# EAGLE design ledpar56 (EAGLE 6.4)
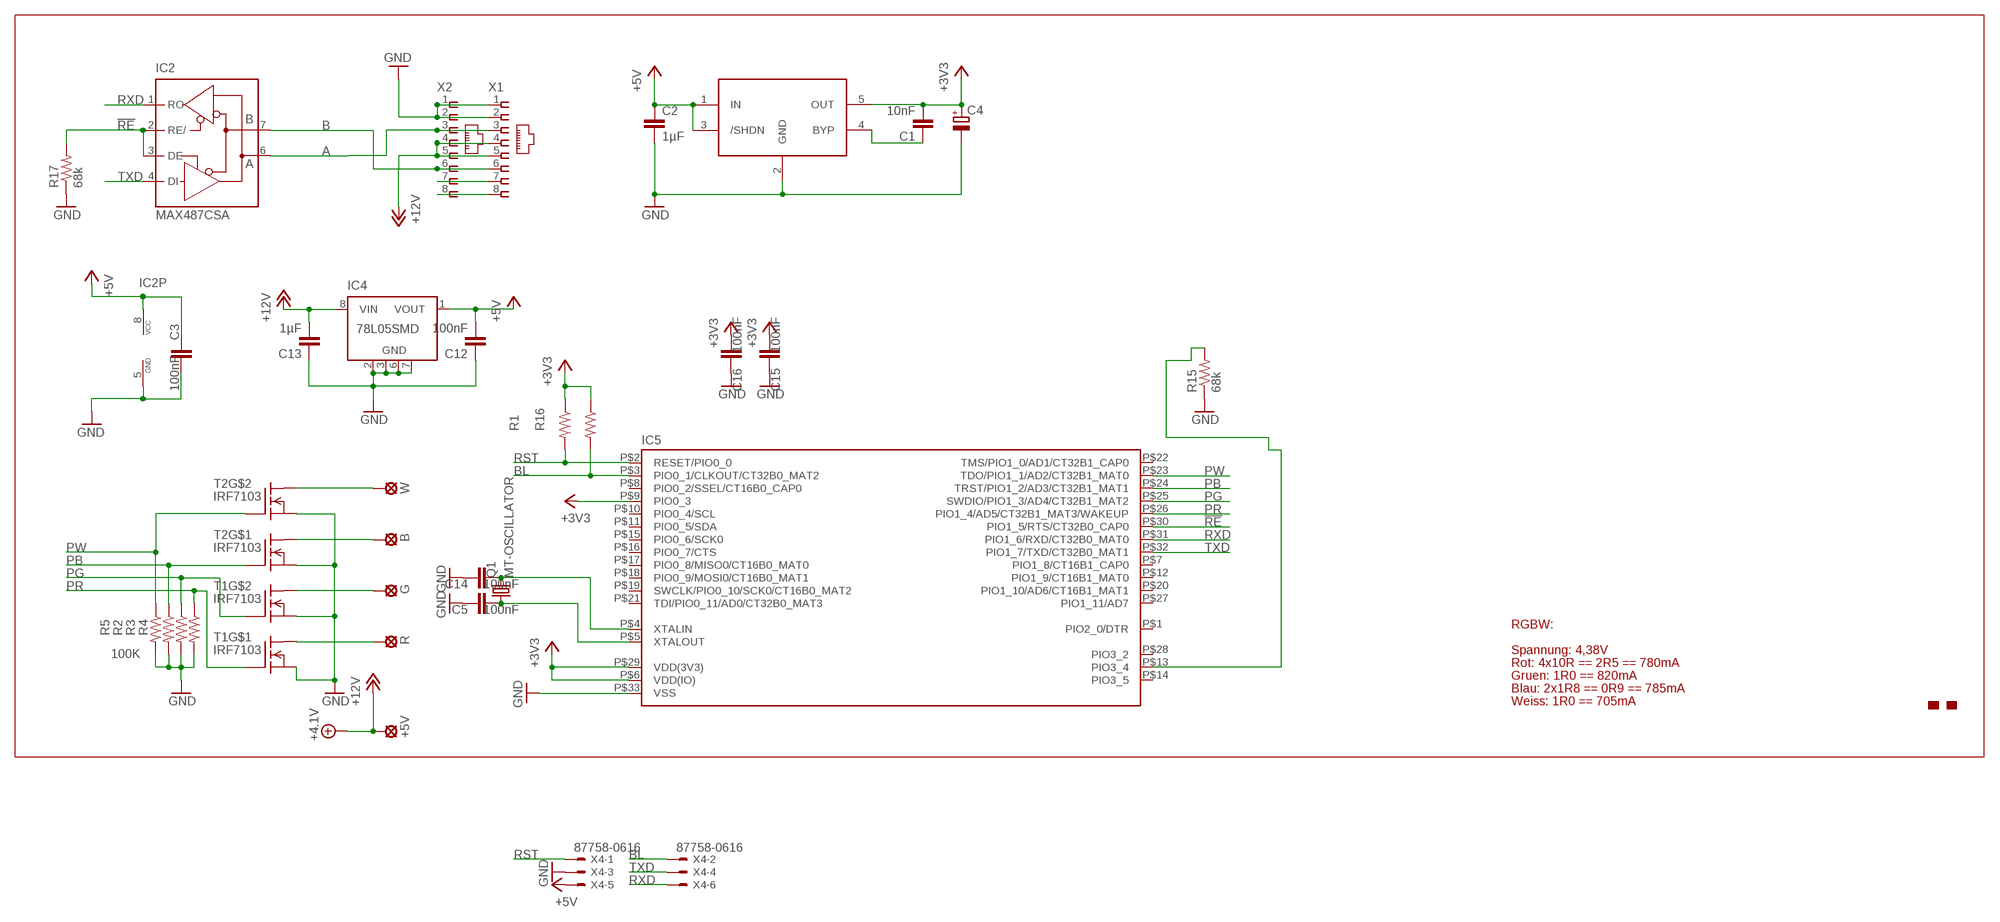
[diagram p0: schematic, sheet 1]

## Parts
+5V  SE14  [SE14]
B  SE14  [SE14]
C1  10nF  C-EUC0402  [C0402]
C2  1µF  CAP0805  [0805]
C3  100nF  CAP0402-CAP  [0402-CAP]
C4  CPOL-EUSMCA  [SMC_A]
C5  100nF  CAP0402-CAP  [0402-CAP]
C12  100nF  CAP0402-CAP  [0402-CAP]
C13  1µF  CAP0805  [0805]
C14  100nF  CAP0402-CAP  [0402-CAP]
C15  100nF  CAP0402-CAP  [0402-CAP]
C16  100nF  CAP0402-CAP  [0402-CAP]
G  SE14  [SE14]
IC1  LT1761  [SOT23-5L]
IC2  MAX487CSA  MAX481CSA  [SO08]
IC4  78L05SMD  [SO08]
IC5  LPC1113/4_QFN  [HVQFN33-7X7]
Q1  MT-OSCILLATOR  [MT]
R  SE14  [SE14]
R1  100K  RESISTOR0402-RES  [0402-RES]
R2  100K  RESISTOR0402-RES  [0402-RES]
R3  100K  RESISTOR0402-RES  [0402-RES]
R4  100K  RESISTOR0402-RES  [0402-RES]
R5  100K  RESISTOR0402-RES  [0402-RES]
R15  68k  RESISTOR0402-RES  [0402-RES]
R16  100K  RESISTOR0402-RES  [0402-RES]
R17  68k  RESISTOR0402-RES  [0402-RES]
T1  IRF7103  [SO-8]
T2  IRF7103  [SO-8]
U$1  MAKE-DD_LOGO'PROMPT'  [MAKE-DD_LOGO_PROMPT]
W  SE14  [SE14]
X1  RJ45-8L-B  [RJ45-NO-SHIELD]
X2  RJ45-8L-B  [RJ45-NO-SHIELD]
X4  87758-0616  [87758-0616]

## Nets
!RE: IC2.2(RE/) IC2.3(DE) IC5.P$30(PIO1_5/RTS/CT32B0_CAP0) R17.2
+3V3: C1.2 C4.+ C15.2 C16.2 IC1.5(OUT) IC5.P$6(VDD(IO)) IC5.P$9(PIO0_3) IC5.P$29(VDD(3V3)) R1.1 R16.1
+5V: C2.1 C3.1 C12.2 IC1.1(IN) IC1.3(/SHDN) IC2.8(VCC) IC4.1(VOUT) X4.5
+12V: +5V.MP C13.2 IC4.8(VIN) X1.4 X1.5 X2.4 X2.5 ; supply symbol labelled +4.1V
A: IC2.6(A) X1.3 X2.3
B: IC2.7(B) X1.6 X2.6
BL: IC5.P$3(PIO0_1/CLKOUT/CT32B0_MAT2) R16.2 X4.2
GND: C2.2 C3.2 C4.- C5.1 C12.1 C13.1 C14.1 C15.1 C16.1 IC1.2(GND) IC2.5(GND) IC4.2(GND) IC4.3(GND) IC4.6(GND) IC4.7(GND) IC5.P$33(VSS) R2.2 R3.2 R4.2 R5.2 R15.1 R17.1 T1.1(S) T1.3(S) T2.1(S) T2.3(S) X1.1 X1.2 X2.1 X2.2 X4.3
N$1: R.MP T1.8(D1)
N$2: T2.5(D1) W.MP
N$7: C1.1 IC1.4(BYP)
N$8: G.MP T1.5(D1)
N$9: B.MP T2.8(D1)
N$12: IC5.P$13(PIO3_4) R15.2
N$18: X1.7 X2.7
N$19: X1.8 X2.8
N$20: C5.2 IC5.P$5(XTALOUT) Q1.1
N$21: C14.2 IC5.P$4(XTALIN) Q1.3
PB: IC5.P$24(TRST/PIO1_2/AD3/CT32B1_MAT1) R2.1 T2.2(G)
PG: IC5.P$25(SWDIO/PIO1_3/AD4/CT32B1_MAT2) R3.1 T1.4(G)
PR: IC5.P$26(PIO1_4/AD5/CT32B1_MAT3/WAKEUP) R4.1 T1.2(G)
PW: IC5.P$23(TDO/PIO1_1/AD2/CT32B1_MAT0) R5.1 T2.4(G)
RST: IC5.P$2(RESET/PIO0_0) R1.2 X4.1
RXD: IC2.1(RO) IC5.P$31(PIO1_6/RXD/CT32B0_MAT0) X4.6
TXD: IC2.4(DI) IC5.P$32(PIO1_7/TXD/CT32B0_MAT1) X4.4
Unconnected: IC4.4(NC) IC4.5(NC) IC5.P$1(PIO2_0/DTR) IC5.P$7(PIO1_8/CT16B1_CAP0) IC5.P$8(PIO0_2/SSEL/CT16B0_CAP0) IC5.P$10(PIO0_4/SCL) IC5.P$11(PIO0_5/SDA) IC5.P$12(PIO1_9/CT16B1_MAT0) IC5.P$14(PIO3_5) IC5.P$15(PIO0_6/SCK0) IC5.P$16(PIO0_7/CTS) IC5.P$17(PIO0_8/MISO0/CT16B0_MAT0) IC5.P$18(PIO0_9/MOSI0/CT16B0_MAT1) IC5.P$19(SWCLK/PIO0_10/SCK0/CT16B0_MAT2) IC5.P$20(PIO1_10/AD6/CT16B1_MAT1) IC5.P$21(TDI/PIO0_11/AD0/CT32B0_MAT3) IC5.P$22(TMS/PIO1_0/AD1/CT32B1_CAP0) IC5.P$27(PIO1_11/AD7) IC5.P$28(PIO3_2) T1.6(D) T1.7(D) T2.6(D) T2.7(D)

## Notes on the sheet
- RGBW:
- Spannung: 4,38V
- Rot: 4x10R == 2R5 == 780mA
- Gruen: 1R0 == 820mA
- Blau: 2x1R8 == 0R9 == 785mA
- Weiss: 1R0 == 705mA

## Library data of the parts
+5V B G R W = solpad:SE14: SOLDER PAD E1553, drill 1,4mm, distributor Buerklin, 07F820
C1 = rcl:C-EU: CAPACITOR, European symbol
C2 = SparkFun-Capacitors:CAP: Capacitor Standard 0603 ceramic capacitor, and 0.1" leaded capacitor.
C3 C5 C12-C16 = SparkFun:CAP: Capacitor Standard 0603 ceramic capacitor, and 0.1" leaded capacitor.
C4 = rcl:CPOL-EU: POLARIZED CAPACITOR, European symbol
IC1 = seb:LT1761
IC2 = maxim:MAX481CSA: RS485 TRANSEIVER; MF: MAXIM; MPN: MAX481CSA; OC_FARNELL: unknown; OC_NEWARK: 90C3817
IC4 = linear:78L*SMD: Positive VOLTAGE REGULATOR
IC5 = microbuilder:LPC1113/4_QFN: LPC1113/4 ARM Cortex-M0 processor, running at frequencies of up to 50 MHz. QFN 33 Pin Package; DIGIKEY#: 568-4948-ND; MANF: NXP; MANF#: LPC1114FHN33/301,5
Q1 = seb:MT-OSCILLATOR
R1-R5 R15-R17 = SparkFun:RESISTOR: Resistor Basic schematic elements and footprints for 0603, 1206, and PTH resistors.
T1 T2 = transistor-fet+irf7201:IRF7103
U$1 = seb:MAKE-DD_LOGO
X1 X2 = con-tycoelectronics:RJ45: CORCOM Modular RJ Jacks No Shield Source: www.tycoelectronics.com .. ENG_DS_1654001_1099_RJ_L_0507.pdf; MF: TYCO ELECTRONICS; MPN: RJ45-8L-B; OC_FARNELL: 1279843; OC_NEWARK: 52K4445
X4 = con-molex:87758-0616: 6 Pin - 2mm Dual Row Single Wafer, Vertical T/H HDR Source: http://www.molex.com/pdm_docs/sd/877580616_sd.pdf; MPN: 87758-0616; OC_FARNELL: 7472323; OC_NEWARK: 25M5667

## Board
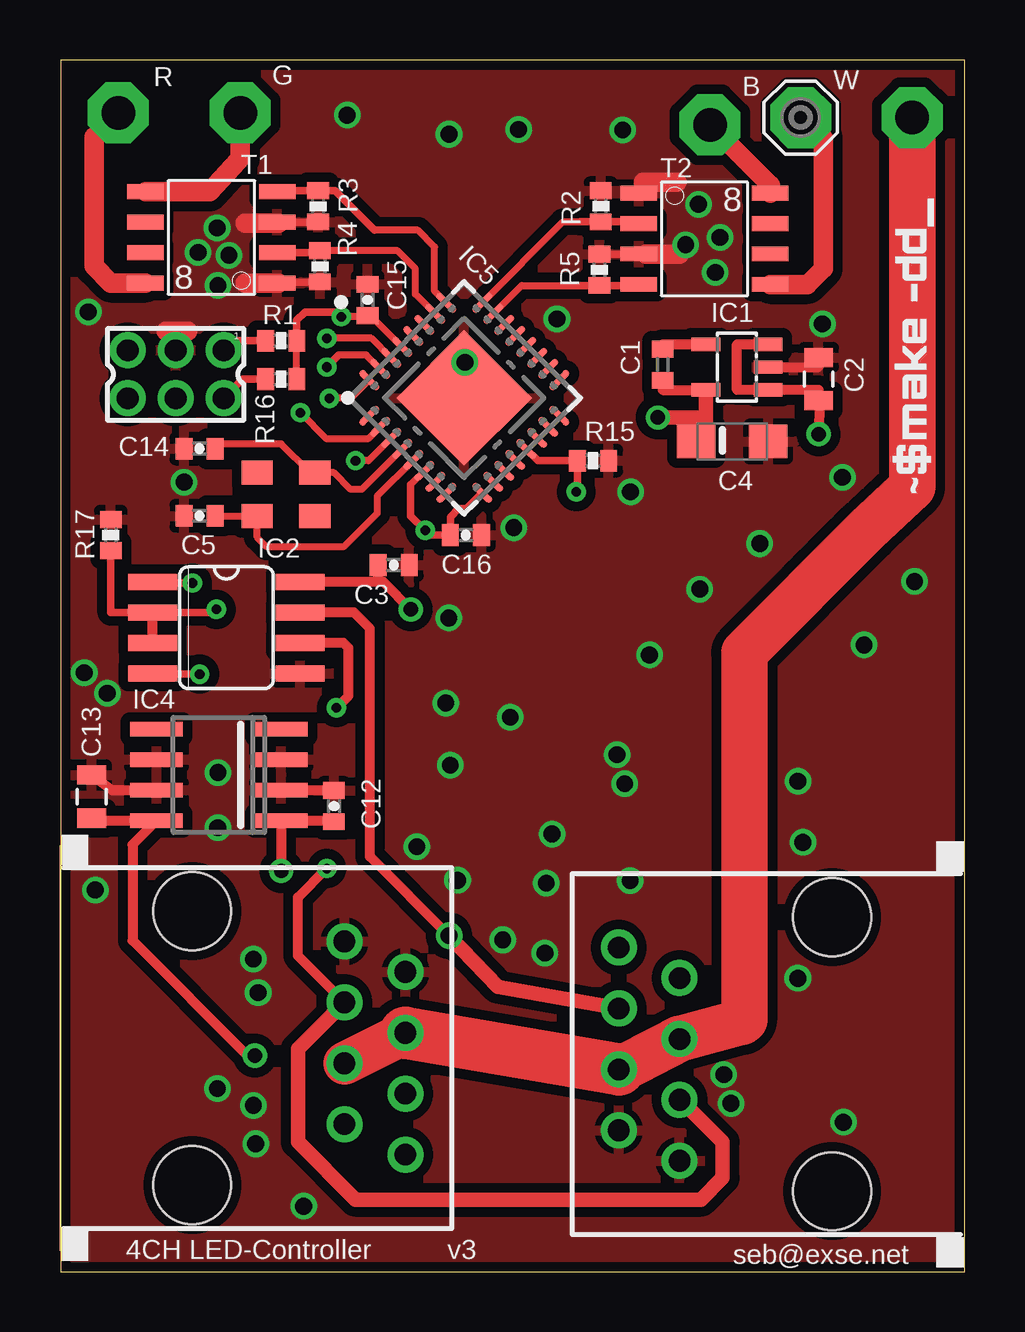
[diagram p1: board, top side]
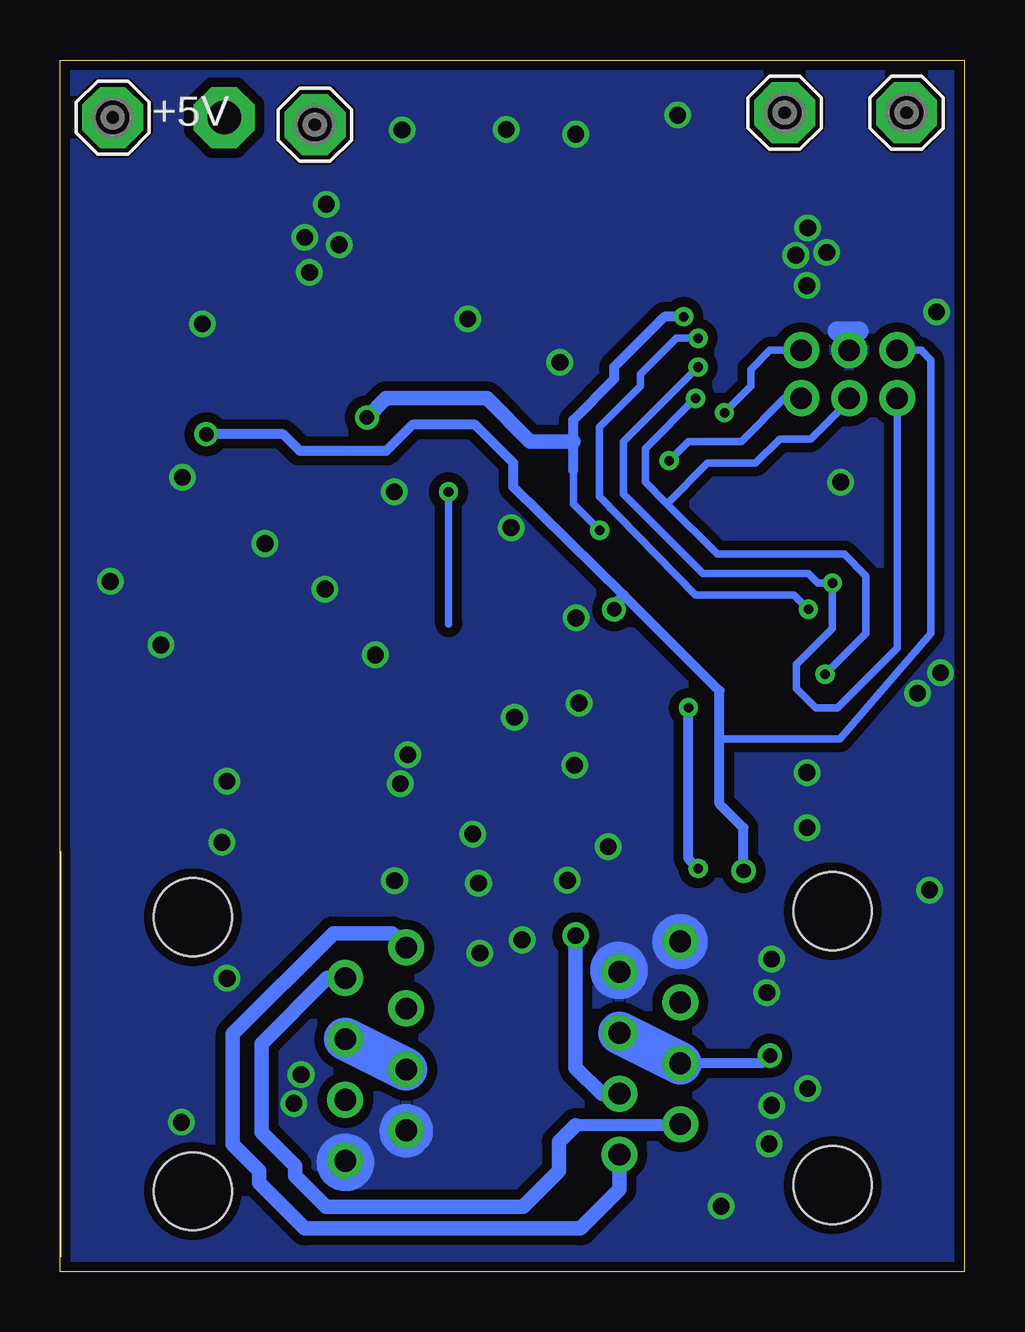
[diagram p2: board, bottom side, seen from below]

Size 37.72 x 50.5 mm. Coordinates in mm from the lower left corner, seen from the top.
Outline: 0.02,0 37.72,0 37.72,50.5 0.02,50.5 0.02,0
Copper layers (1*16): Top 0.035mm / dielectric 1.5mm / Bottom 0.035mm
Design rules "default *": minimum track width 0.2mm, minimum drill 0.4mm, track to track 0.2mm, track to pad 0.2mm, pad to pad 0.2mm, via to via 0.2mm, smd to smd 0mil, copper to edge 0.4mm, drill to drill 8mil, minimum pad ring 0.3mm, minimum via ring 8mil, stop-mask expansion 4mil, vias tented up to drill 40mil, thermal gap 10mil

### Footprints (pad centres in the part's own frame; a part is rotated, then mirrored left to right if it is on the bottom)
SE14 = drill 1.397 pad 2.54 octagon: MP 0,0
C0402 = smd 0.7 x 0.9: 1 -0.65,0; 2 0.65,0
0805 = smd 0.8 x 1.2: 1 -0.9,0; 2 0.9,0
0402-CAP = smd 0.7 x 0.9: 1 -0.65,0; 2 0.65,0
SMC_A = smd 1.6 x 1.4: + -1.5,0; - 1.5,0
SOT23-5L = smd 0.55 x 1.2: 1 -0.95,-1.3; 2 0,-1.3; 3 0.95,-1.3; 4 0.95,1.3; 5 -0.95,1.3
SO08 = smd 0.66 x 2.032: 1 -1.905,-3.073; 2 -0.635,-3.073; 3 0.635,-3.073; 4 1.905,-3.073; 5 1.905,3.073; 6 0.635,3.073; 7 -0.635,3.073; 8 -1.905,3.073
SO08' = smd 0.6 x 2.2: 1 -1.905,-2.6; 2 -0.635,-2.6; 3 0.635,-2.6; 4 1.905,-2.6; 5 1.905,2.6; 6 0.635,2.6; 7 -0.635,2.6; 8 -1.905,2.6
HVQFN33-7X7 = smd 1.067 x 0.3: P$1 -3.327,2.275; P$2 -3.327,1.625; P$3 -3.327,0.975; P$4 -3.327,0.325; P$5 -3.327,-0.325; P$6 -3.327,-0.975; P$7 -3.327,-1.625; P$8 -3.327,-2.275; P$17 3.327,-2.275; P$18 3.327,-1.625; P$19 3.327,-0.975; P$20 3.327,-0.325; P$21 3.327,0.325; P$22 3.327,0.975; P$23 3.327,1.625; P$24 3.327,2.275 | smd 0.3 x 1.067: P$9 -2.275,-3.327; P$10 -1.625,-3.327; P$11 -0.975,-3.327; P$12 -0.325,-3.327; P$13 0.325,-3.327; P$14 0.975,-3.327; P$15 1.625,-3.327; P$16 2.275,-3.327; P$25 2.275,3.327; P$26 1.625,3.327; P$27 0.975,3.327; P$28 0.325,3.327; P$29 -0.325,3.327; P$30 -0.975,3.327; P$31 -1.625,3.327; P$32 -2.275,3.327 | smd 4 x 4: P$33 0,0
MT = smd 1.3 x 1: 1 1.2,0.9; 2 -1.2,0.9; 3 -1.2,-0.9; 4 1.2,-0.9
0402-RES = smd 0.7 x 0.9: 1 -0.65,0; 2 0.65,0
SO-8 = smd 1.524 x 0.61: 1 -2.743,1.27; 2 -2.743,0; 3 -2.743,-1.27; 4 -2.743,-2.54; 5 2.743,-2.54; 6 2.743,-1.27; 7 2.743,0; 8 2.743,1.27
RJ45-NO-SHIELD = drill 0.9 pad 1.4: 1 -4.445,6.35; 2 -3.175,8.89; 3 -1.905,6.35; 4 -0.635,8.89; 5 0.635,6.35; 6 1.905,8.89; 7 3.175,6.35; 8 4.445,8.89 | hole 3.251: -5.715,0; 5.715,0
87758-0616 = drill 0.9 pad 1.27: 1 -2,-1; 2 -2,1; 3 0,-1; 4 0,1; 5 2,-1; 6 2,1

### Placement (x,y rotation side)
+5V  35.52,48.1 0 bottom
B  27.09,47.8 0 bottom
C1  25.12,37.8 270 top
C2  31.62,37.2 90 top
C3  13.91,29.45 0 top
C4  28.02,34.6 0 top
C5  5.82,31.5 0 top
C12  11.42,19.4 270 top
C13  1.32,19.8 270 top
C14  5.82,34.3 0 top
C15  12.82,40.5 270 top
C16  16.92,30.7 180 top
G  7.51,48.3 0 bottom
IC1  28.22,37.7 90 top
IC2  6.94,26.84 270 top
IC4  78L05SMD  [SO08']  6.62,20.7 90 top
IC5  16.85,36.41 45 top
Q1  9.42,32.4 180 top
R  2.43,48.3 0 bottom
R1  9.22,38.8 180 top
R2  22.54,44.4 90 top
R3  10.76,44.4 270 top
R4  10.84,41.9 270 top
R5  22.49,41.75 90 top
R15  22.22,33.8 180 top
R16  9.22,37.2 180 top
R17  2.12,30.7 270 top
T1  6.31,42.47 180 top
T2  26.87,43.68 0 top
U$1  36.12,32.6 90 top
W  30.88,48.1 0 top
X1  32.18,9.06 90 top
X2  5.51,9.31 270 top
X4  4.82,37.4 180 top

### Tracks (layer width: path | path; a pad name or v marks a point on that pad's centre or on a via)
!RE  (via drill 0.4)
  Top 0.3: IC5.P$30 12.99,38.9 v11.12,38.9
  Top 0.305: v6.52,27.6 6.39,27.47 IC2.2 2.12,27.47 R17.2
  Top 0.406: IC2.3 IC2.2
  Bottom 0.305: v11.12,38.9 12.02,38.9 13.52,37.4 13.52,36.9 15.22,35.2 15.22,32.3 11.22,28.2 7.12,28.2 v6.52,27.6
+3V3  (via drill 0.4, 0.6)
  Top 0.3: IC5.P$6 14.62,32.8 | IC5.P$29 12.95,39.85 C15.2 12.77,39.8 v11.72,39.8 | R16.1 R1.1
  Top 0.305: 14.62,32.8 14.62,31.5 v15.22,30.9 15.42,30.7 C16.2 16.27,31.45 16.62,31.8 16.94,31.8 IC5.P$9 | R1.1 9.87,39.65 10.22,40 11.52,40 v11.72,39.8
  Top 0.406: C1.2 25.12,36.75 IC1.5
  Top 0.61: IC1.5 26.92,35.5 | 26.92,35.5 26.92,34.4 C4.+ | v24.92,35.6 26.82,35.6 26.92,35.5
  Bottom 0.305: v15.22,30.9 16.32,32 16.32,33.4
  Bottom 0.406: v11.72,39.8 12.52,39.8 14.62,37.7 14.62,37.2 16.32,35.5 16.32,34.6 16.32,33.4
  Bottom 0.61: v24.92,35.6 24.12,36.4 19.92,36.4 18.12,34.6 16.32,34.6
+5V  (via drill 0.6)
  Top 0.406: C12.2 11.32,18.8 IC4.1 v9.22,16.7 | 13.22,28.74 13.48,28.74 v14.62,27.6 | 13.22,28.74 IC2.8 | v31.62,34.9 31.67,36.25 31.62,36.75 | 31.62,36.75 IC1.1 28.22,36.75 28.22,38.65 IC1.3 | C2.1 31.62,36.75 | C3.1 13.26,28.78 13.22,28.74
  Bottom 0.305: X4.5 1.82,38.4 1.42,38 1.42,26.6 5.22,22.2 10.22,22.2
  Bottom 0.406: v9.22,16.7 9.22,18.5 10.22,19.5 10.22,22.2 10.22,24.2 14.22,28.2 | 14.22,28.2 18.82,32.7 18.82,33.7 20.42,35.3 23.02,35.3 24.12,34.2 27.72,34.2 28.42,34.9 v31.62,34.9 | v14.62,27.6 14.62,27.8 14.22,28.2
+12V  (via drill 0.6)
  Top 0.406: v8.12,9 7.82,9 3.02,13.8 3.02,17.8 IC4.8 1.63,18.8 C13.2
  Top 1.016: X1.4 20.4,8.43
  Top 1.778: X2.5 X2.4
  Top 1.93: X1.5 23.32,8.4 X1.5 28.42,10.4 28.52,10.5 28.52,25.8 33.62,30.9 35.52,32.7 +5V.MP
  Top 2.184: X2.4 X1.4
  Bottom 0.406: v8.12,9 8.44,8.68 X2.5
  Bottom 1.778: X1.4 X1.5 | X2.5 X2.4
A  (via drill 0.4)
  Top 0.406: IC2.6 11.82,26.2 12.02,26 12.02,24 v11.52,23.5 | X2.3 9.92,13.16 9.92,15.6 v11.12,16.8
  Top 0.61: X1.3 25.87,7.16 27.62,5.4 27.62,3.9 26.72,3 12.32,3 9.92,5.4 9.92,9.28 X2.3
  Bottom 0.406: v11.52,23.5 11.52,17.2 v11.12,16.8
B  (via drill 0.7)
  Top 0.406: IC2.7 12.25,27.47 12.92,26.8 12.92,17.3 v16.22,14
  Top 0.61: X1.6 18.26,11.87 v16.22,14
  Bottom 0.61: v16.22,14 16.22,8.5 15.13,7.41 X2.6
BL  (via drill 0.4)
  Top 0.3: IC5.P$3 12.86,33.8 v12.32,33.8
  Top 0.305: R16.2 7.62,37.2 X4.2
  Bottom 0.305: v12.32,33.8 11.52,34.6 9.32,34.6 7.52,36.4 X4.2
GND  (via drill 0.7)
  Top 0.3: 9.21,41.25 9.16,41.2 T1.1
  Top 0.305: R5.2 T2.3 | T1.3 9.07,43.75 R3.2 | 9.21,41.25 R4.2 | 5.32,39.2 5.32,39.3 X4.3
  Top 0.406: C13.1 2.16,20.07 IC4.7 | IC4.2 11.49,20.07 C12.1 | 9.02,41.2 T1.1 | IC1.2 31.62,37.7 C2.2
  Top 0.61: IC5.P$33 16.88,36.44 v16.88,37.9
  Top 0.813: 24.32,45.4 25.72,45.4 | 26.02,42.7 25.82,42.5 25.82,42.4 24.42,42.4 | 7.72,43.7 9.12,43.7 | 7.72,41.2 9.12,41.2 | 5.32,39.2 4.42,39.2
  Bottom 0.305: 5.32,39.2 4.82,39.2 X4.3
  Bottom 0.61: 11.02,13.7 arc353 11.02,13.8 11.82,13.8 X2.1 | 13.52,12.6 arc-354 13.52,12.5 | 24.92,4.6 arc-354 24.92,4.5 | X1.2 22.91,5.5 22.82,5.2 arc340 22.62,5.4
  Bottom 0.813: 5.32,39.2 4.42,39.2
  other vias: 19.12,47.61 23.46,47.58 27.32,41.64 26.62,44.48 27.52,43.11 26.08,42.8 23.78,32.5 29.17,30.34 31.78,39.5 35.63,28.76 33.52,26.12 5.76,42.48 6.55,43.5 7.04,42.36 6.58,41.1 26.67,28.44 30.97,17.89 30.76,20.44 1.18,40 1.01,24.96 1.97,24.1 6.58,20.8 18.77,23.1 16.21,27.24 6.57,18.5 23.22,21.54 16.08,23.7 16.27,21.11 23.77,16.29 23.54,20.33 14.87,17.71 20.52,18.23 27.67,8.21 27.97,7.01 20.27,16.19 16.57,16.31 18.46,13.82 20.21,13.28 8.06,6.92 6.56,7.62 8.26,11.62 8.06,13.02 10.16,2.72 8.16,5.32 30.76,12.22 32.66,6.22 16.22,47.41 20.72,39.71 18.92,31.01 32.62,33.11 1.47,15.9 24.57,25.7 11.97,48.2 5.17,32.9
  pour Bottom (isolate 0.406, rank 2): 0.06,53.88 0.02,0 37.71,0 37.7,53.88
  pour Top (isolate 0.406, rank 2): 0.04,53.85 0.02,0 37.74,0 37.7,53.88
N$1
  Top 0.813: T1.8 2.12,41.2 1.42,41.9 1.42,47.29 R.MP
N$2
  Top 0.813: T2.5 31.16,41.14 31.82,41.8 31.82,47.25 31.73,47.25 W.MP
N$7
  Top 0.406: C1.1 25.12,38.65 IC1.4
N$8
  Top 0.813: T1.5 6.23,45.01 7.42,46.3 7.51,46.41 G.MP
N$9
  Top 0.813: T2.8 29.61,45.28 B.MP
N$12  (via drill 0.4)
  Top 0.305: IC5.P$13 19.92,33.8 R15.2 21.57,32.55 v21.52,32.5
  Bottom 0.305: 21.52,27 v21.52,32.5
N$18
  Bottom 0.5: 11.9,6.1 16.22,6.1
  Bottom 0.61: X1.7 26.59,12.23 29.32,9.5 29.32,5.8 27.92,4.4 27.92,4 26.62,2.7 18.42,2.7 16.92,4.2 16.92,5.4 16.22,6.1 | X2.7 11.9,6.1
N$19
  Bottom 0.61: X1.8 23.89,14.1 26.32,14.1 30.52,9.9 30.52,5.3 29.42,4.2 29.42,3.7 27.52,1.8 16.02,1.8 14.4,3.42 X2.8
N$20
  Top 0.3: IC5.P$5 13.22,32.32 13.22,31.6 11.82,30.2 8.62,30.2 8.22,30.6 Q1.1 C5.2
N$21
  Top 0.3: IC5.P$4 12.58,32.6 12.12,32.6 11.42,33.3 Q1.3 10.42,33.3 9.22,34.5 6.52,34.5 C14.2
PB
  Top 0.3: IC5.P$24 20.97,43.75 R2.1
  Top 0.305: T2.2 24.05,43.75 R2.1 21.67,43.75
PG
  Top 0.3: IC5.P$25 15.62,40.86 15.62,42.7 14.92,43.4 13.12,43.4
  Top 0.305: 13.12,43.4 11.47,45.05 R3.1 9.1,45.05 T1.4
PR
  Top 0.3: IC5.P$26 14.82,40.74 14.82,41.8 14.07,42.55 R4.1
  Top 0.305: 10.98,42.4 R4.1 10.76,42.47 T1.2
PW
  Top 0.3: IC5.P$23 19.24,41.1 R5.1
  Top 0.305: T2.4 24.09,41.1 R5.1 21.72,41.1
RST  (via drill 0.4)
  Top 0.3: IC5.P$2 12.84,34.7 11.12,34.7 v10.02,35.8
  Top 0.305: R1.2 7.22,38.8 X4.1
  Bottom 0.305: v10.02,35.8 8.92,36.9 8.92,37.6 8.12,38.4 X4.1
RXD  (via drill 0.4)
  Top 0.3: IC5.P$31 12.77,38.2 11.62,38.2
  Top 0.305: v5.52,28.7 3.91,28.7 IC2.1 | v11.12,37.7 11.62,38.2
  Bottom 0.305: v11.12,37.7 14.22,34.6 14.22,32.4 10.92,29.1 6.52,29.1 6.12,28.7 v5.52,28.7 5.52,26.8 7.02,25.3 7.02,24.3 6.22,23.5 5.32,23.5 2.82,26 X4.6
TXD  (via drill 0.4)
  Top 0.3: IC5.P$32 12.13,36.4 v11.22,36.4
  Top 0.305: v5.82,24.9 3.9,24.9 IC2.4
  Bottom 0.305: v5.82,24.9 4.12,26.6 4.12,29 5.02,29.9 10.32,29.9 12.42,32 | v11.22,36.4 13.32,34.3 13.32,32.9 12.42,32 | X4.4 4.82,36.3 6.42,34.7 7.72,34.7 8.72,33.7 10.72,33.7 12.42,32

### Text on the board
tPlace: seb@exse.net | 4CH LED-Controller | v3
_tNames: R | G | B | W | R13 | R12 | R10 | R14 | R11 | R2 | T2 | R3 | R4 | R5 | T1 | C2 | C3 | C5 | Q1 | R1 | ISP | C4 | IC1 | C8 | IC2 | C1 | R15 | L1 | C10 | R8 | D1 | IC3 | IC4 | C11 | R9 | R7 | C13 | C12 | R6 | C7 | C6 | C9
_bNames: +5V
_tValues: SE14 | 100K | MEGA48/88/168-AU | 3,3µH | 8.2µH | 47µF 16V | 68k | 68k | 680pF | MBRS340 | 18k | 78L05SMD | 33k | 1µF | 1µF | 100nF | LT3972 | 4.7µF 50V | 150k | 4.7µF 50V | RJ45-8L-B | 4.7µF 50V | RJ45-8L-B